# Altium schematic sheet iF11P.SchDoc
size A; SheetNumber: 1; SheetTotal: 1
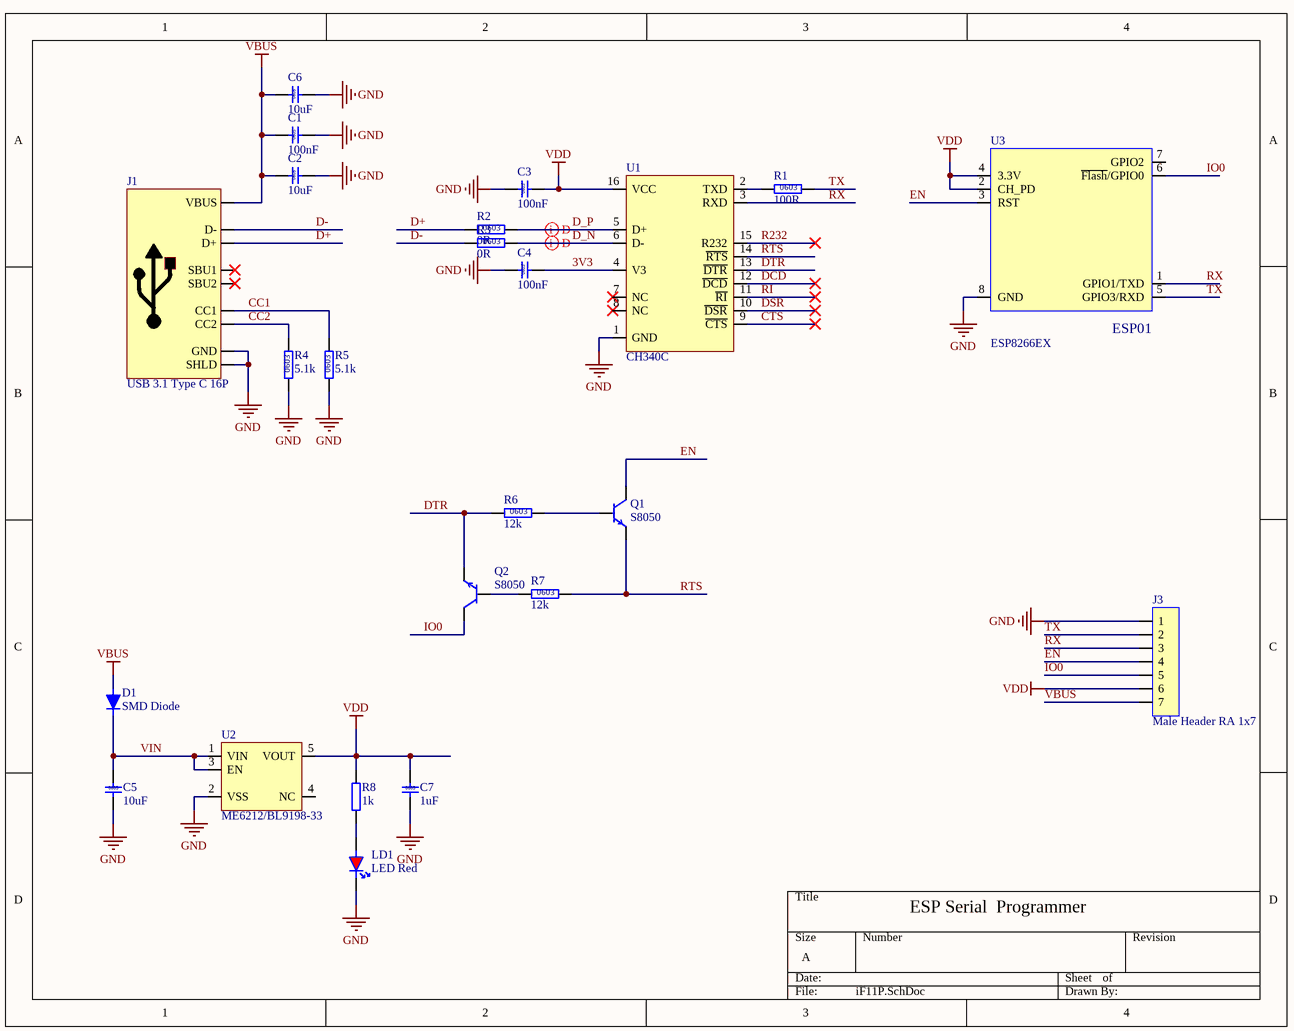
[diagram p0: iF11P.SchDoc]

## Parts
C1  100nF  [C0603]
C2  10uF  [C0805]
C3  100nF  [C0603]
C4  100nF  [C0603]
C5  10uF  [C0805]
C6  10uF  [C0805]
C7  1uF  [C0603]
D1  SMD Diode  [SOD-323]
J1  USB 3.1 Type C 16P  [USBC-16P]
J3  Male Header RA 1x7  [MHEADER-RA-1x7]
LD1  LED Red  [LED-0603-RED]
Q1  S8050  [SOT23]
Q2  S8050  [SOT23]
R1  100R  [R0603-LD]
R2  0R  [R0603-LD]
R3  0R  [R0603-LD]
R4  5.1k  [R0603-LD]
R5  5.1k  [R0603-LD]
R6  12k  [R0603-LD]
R7  12k  [R0603-LD]
R8  1k  [R0805]
U1  CH340C  [SOP16-5.6-1.27]
U2  ME6212/BL9198-33  [SOT23-5]
U3  ESP8266EX  [ESP-01]

## Nets
GND: C1.2 C2.2 C3.1 C4.1 C5.2 C6.2 C7.2 J1.1(GND) J1.10(SHLD) J3.1 LD1.2(K) R4.1 R5.1 U1.1(GND) U2.2(VSS) U3.8(GND)
VBUS: C1.1 C2.1 C6.1 D1.1(A) J1.2(VBUS) J3.7
VDD: C3.2 C7.1 J3.6 R8.2 U1.16(VCC) U2.5(VOUT) U3.2(CH_PD) U3.4(3.3V)
3V3: C4.2 U1.4(V3)
CC1: J1.4(CC1) R5.2
CC2: J1.8(CC2) R4.2
CTS: U1.9(~{CTS})
D+: J1.6(D+) R2.1
D-: J1.5(D-) R3.1
D_N: R3.2 U1.6(D-)
D_P: R2.2 U1.5(D+)
DCD: U1.12(~{DCD})
DSR: U1.10(~{DSR})
DTR: Q2.2(E) R6.1 U1.13(~{DTR})
EN: J3.4 Q1.3(C) U3.3(RST)
IO0: J3.5 Q2.3(C) U3.6(~{Flash}/GPIO0)
R232: U1.15(R232)
RI: U1.11(~{RI})
RTS: Q1.2(E) R7.2 U1.14(~{RTS})
RX: J3.3 U1.3(RXD) U3.1(GPIO1/TXD)
TX: J3.2 R1.2 U3.5(GPIO3/RXD)
VIN: C5.1 D1.2(K) U2.1(VIN) U2.3(EN)
NetLD1_1: LD1.1(A) R8.1
NetQ1_1: Q1.1(B) R6.2
NetQ2_1: Q2.1(B) R7.1
NetR1_1: R1.1 U1.2(TXD)

Not connected (* = marked no-connect by the designer): J1 3(SBU2)* 7(SBU1)*; U1 7(NC)* 8(NC)*; U2 4(NC); U3 7(GPIO2)

## Layout directives
differential pair; differential pair class 90Ohm: D_N, D_P

## Notes on the sheet
- ESP Serial  Programmer
- (in symbol C 0603 1uF 25V) 0603
- (in symbol C 0603 100nF 50V) 0603
- (in symbol C 0805 10uF 25V) 0805
- (in symbol R 0603 0R) 0603
- (in symbol R 0603 5.1k) 0603
- (in symbol R 0603 12k) 0603
- (in symbol R 0603 100R) 0603

## Library data of the parts
C1 C3 C4 = C 0603 100nF 50V: 10% 16V; Part No: W-T-CA-X703N100K50VNT; Manufacturer: FENGHUA; Material Name: 贴片电容0603 100NF/50V 10%; Product Code: WP0002721; Supplier: 南京南山半导体有限公司
C2 C5 C6 = C 0805 10uF 25V: 10% 25V; Part No: WP0005368; Material Name: 贴片电容0805 10UF/25V 10%; Product Code: WP0005368; Supplier: 深圳市四叶电子有限公司; Manufacturer: *
C7 = C 0603 1uF 25V: 10% 25V; Part No: W-T-CA-X703U001K25VNT; Material Name: 贴片电容0603 1.0UF/25V 10%; Product Code: WP0002774; Supplier: 南京南山半导体有限公司; Manufacturer: *
D1 = Diode-smd
J1 = USB-C-16P: TYPE-C 16PIN L8.35; Part No: W-T-CN-TYPE-C 16P; Material Name: USB 3.1 Type C 16P Connector; Product Code: WP0003709; Supplier: 奥科成电子有限公司
J3 = MHeader-RA-1x7: 7 Pin Male Header Bent/RA
Q1 Q2 = NPN-SOT-23
R1 = R 0603 100R: 5%; Part No: W-T-RE-RS03K101JT; Material Name: 贴片电阻0603 100Ω 5%; Product Code: WP0004026; Supplier: 南京南山半导体有限公司
R2 R3 = R 0603 0R: 5%; Part No: W-T-RE-RS03K0RJT; Manufacturer: 贴片; Material Name: 贴片电阻0603 0Ω 5%; Product Code: WP0002766; Supplier: 南京南山半导体有限公司
R4 R5 = R 0603 5.1k: 5%; Part No: W-T-RE-RS03K512JT; Material Name: 贴片电阻0603 5.1K 5%; Product Code: WP0002939; Supplier: 南京南山半导体有限公司
R6 R7 = R 0603 12k: 5%; Part No: W-T-RE-RS03K123JT; Material Name: 贴片电阻0603 12K 5%; Product Code: WP0003072; Supplier: 南京南山半导体有限公司
R8 = Resistor: 1206
U1 = CH340C: USB to Serial Port chip
U2 = ME6211C28M5G
U3 = ESP01